# Altium schematic sheet VibrationACQ.SchDoc: VibrationACQ
size A4; Author: João Guimarães; Organization: Altium Limited; Address1: L3, 12a Rodborough Rd; Address2: Frenchs Forest; Address3: NSW; Address4: Australia 2086; Revision: 2.0; SheetNumber: 6; SheetTotal: 9
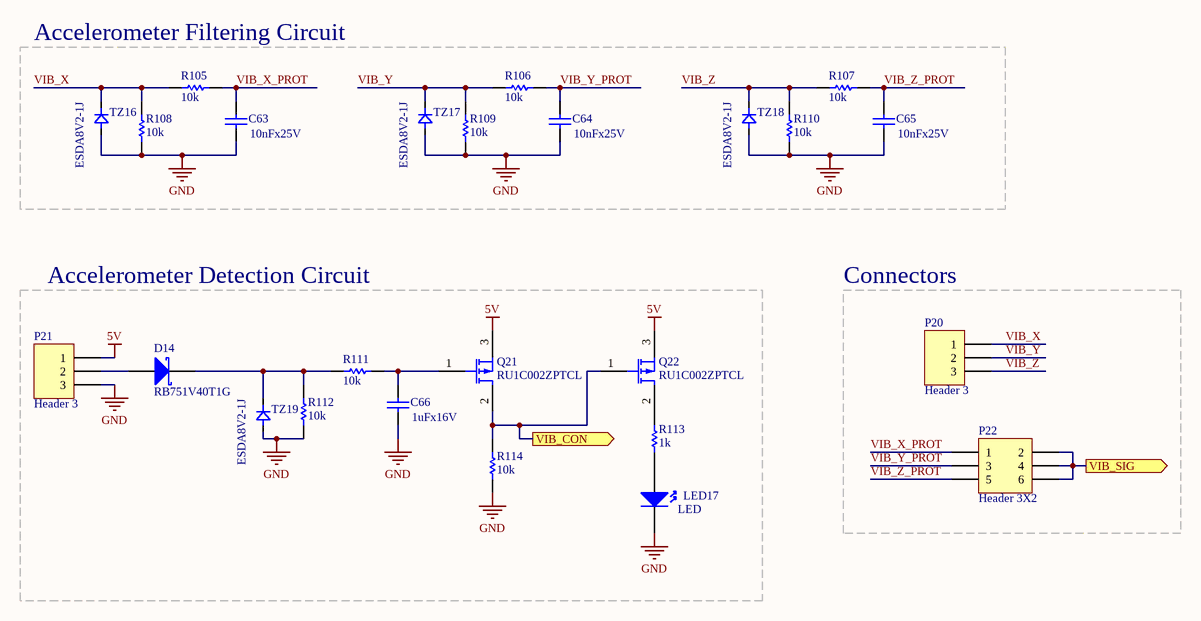
[diagram p0: VibrationACQ.SchDoc]

## Parts
C63  10nFx25V  [DISC-0805]
C64  10nFx25V  [DISC-0805]
C65  10nFx25V  [DISC-0805]
C66  1uFx16V  [DISC-0805]
D14  RB751V40T1G  [DISC-SOD-323]
LED17  LED  [DISC-LED-0.1-PTH]
P20  Header 3  [CON-FLEXWIRE-0.5MM2-1X3]
P21  Header 3  [CON-FLEXWIRE-0.5MM2-1X3]
P22  Header 3X2  [CON-HEADER-2X3-PTH]
Q21  RU1C002ZPTCL  [DISC-SOT-23]
Q22  RU1C002ZPTCL  [DISC-SOT-23]
R105  10k  [DISC-0805]
R106  10k  [DISC-0805]
R107  10k  [DISC-0805]
R108  10k  [DISC-0805]
R109  10k  [DISC-0805]
R110  10k  [DISC-0805]
R111  10k  [DISC-0805]
R112  10k  [DISC-0805]
R113  1k  [DISC-0805]
R114  10k  [DISC-0805]
TZ16  ESDA8V2-1J  [DISC-SOD-323]
TZ17  ESDA8V2-1J  [DISC-SOD-323]
TZ18  ESDA8V2-1J  [DISC-SOD-323]
TZ19  ESDA8V2-1J  [DISC-SOD-323]

## Blocks framed on the sheet
Accelerometer Filtering Circuit: C63-C65 R105-R110 TZ16-TZ18
Accelerometer Detection Circuit: C66 D14 LED17 P21 Q21 Q22 R111-R114 TZ19
Connectors: P20 P22

## Ports
VIB_CON (out), VIB_SIG (out)

## Nets
5V: P21.1 Q21.3(S) Q22.3(S)
GND: C63.1 C64.1 C65.1 C66.1 LED17.2(K) P21.3 R108.2 R109.2 R110.2 R112.2 R114.1 TZ16.1(A) TZ17.1(A) TZ18.1(A) TZ19.1(A)
VIB_CON: Q21.2(D) Q22.1(G) R114.2 ; port VIB_CON
VIB_SIG: P22.2 P22.4 P22.6 ; port VIB_SIG
VIB_X: P20.1 R105.2 R108.1 TZ16.2(C)
VIB_X_PROT: C63.2 P22.1 R105.1
VIB_Y: P20.2 R106.2 R109.1 TZ17.2(C)
VIB_Y_PROT: C64.2 P22.3 R106.1
VIB_Z: P20.3 R107.2 R110.1 TZ18.2(C)
VIB_Z_PROT: C65.2 P22.5 R107.1
NetC66_2: C66.2 Q21.1(G) R111.2
NetD14_1: D14.1(A) P21.2
NetD14_2: D14.2(K) R111.1 R112.1 TZ19.2(C)
NetLED17_1: LED17.1(A) R113.1
NetQ22_2: Q22.2(D) R113.2

## Notes on the sheet
- Title:
- Project:
- Date:
- Author:
- Version:
- Sheet:
- of

## Library data of the parts
C63-C66 = Cap: Capacitor
D14 = D Schottky: Schottky Diode; Published: 8-Jun-2000; LatestRevisionDate: 17-Jul-2002; LatestRevisionNote: Re-released for DXP Platform.; PackageReference: SMB; Publisher: Altium Limited; PackageDescription: DO-214-AA/SMB; 2 C-Bend Leads; Body 5.3 x 3.6 mm, inc. leads (LxW); Code_JEDEC: DO-214-AA
P20 P21 = Header 3: Header, 3-Pin; LatestRevisionDate: 17-Jul-2002; LatestRevisionNote: Re-released for DXP Platform.; Publisher: Altium Limited
P22 = Header 3X2: Header, 3-Pin, Dual row; LatestRevisionDate: 17-Jul-2002; LatestRevisionNote: Re-released for DXP Platform.; Publisher: Altium Limited
Q21 Q22 = Transistor-PMOS: P-Channel MOSFET
R105-R114 = Res: Resistor
TZ16-TZ19 = TVZ-Unidirectional